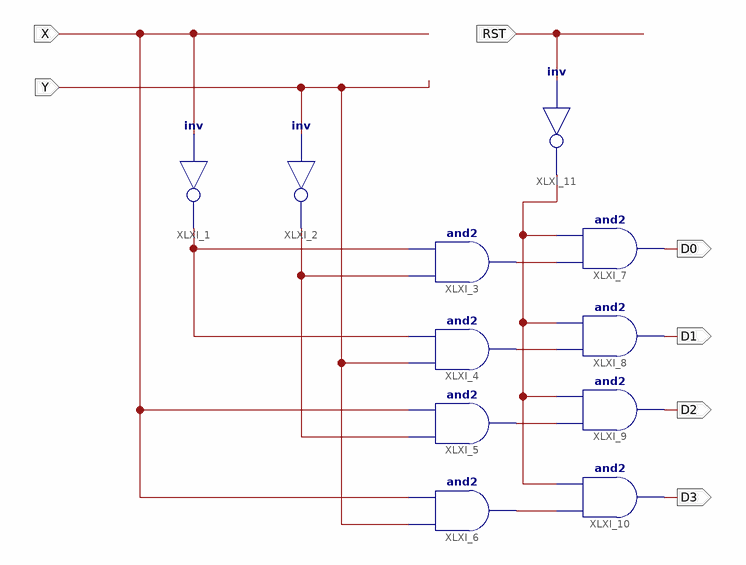
[diagram p0: schematic sheet 1]
// Xilinx ISE schematic decoder2to4.sch (artix7) as structural Verilog: 11 symbols, 7 ports
module decoder2to4 (
  input  X,
  input  Y,
  input  RST,
  output D0,
  output D1,
  output D2,
  output D3
);

  wire XLXN_4, XLXN_5, XLXN_24, XLXN_25, XLXN_26, XLXN_27, XLXN_32;

  not XLXI_1 (XLXN_5, X);
  not XLXI_2 (XLXN_4, Y);
  and XLXI_3 (XLXN_27, XLXN_4, XLXN_5);
  and XLXI_4 (XLXN_26, Y, XLXN_5);
  and XLXI_5 (XLXN_25, XLXN_4, X);
  and XLXI_6 (XLXN_24, Y, X);
  and XLXI_7 (D0, XLXN_27, XLXN_32);
  and XLXI_8 (D1, XLXN_26, XLXN_32);
  and XLXI_9 (D2, XLXN_25, XLXN_32);
  and XLXI_10 (D3, XLXN_24, XLXN_32);
  not XLXI_11 (XLXN_32, RST);
endmodule
